# EAGLE schematic XR_Preamp (EAGLE 6.3)

## Sheet 1 of 2
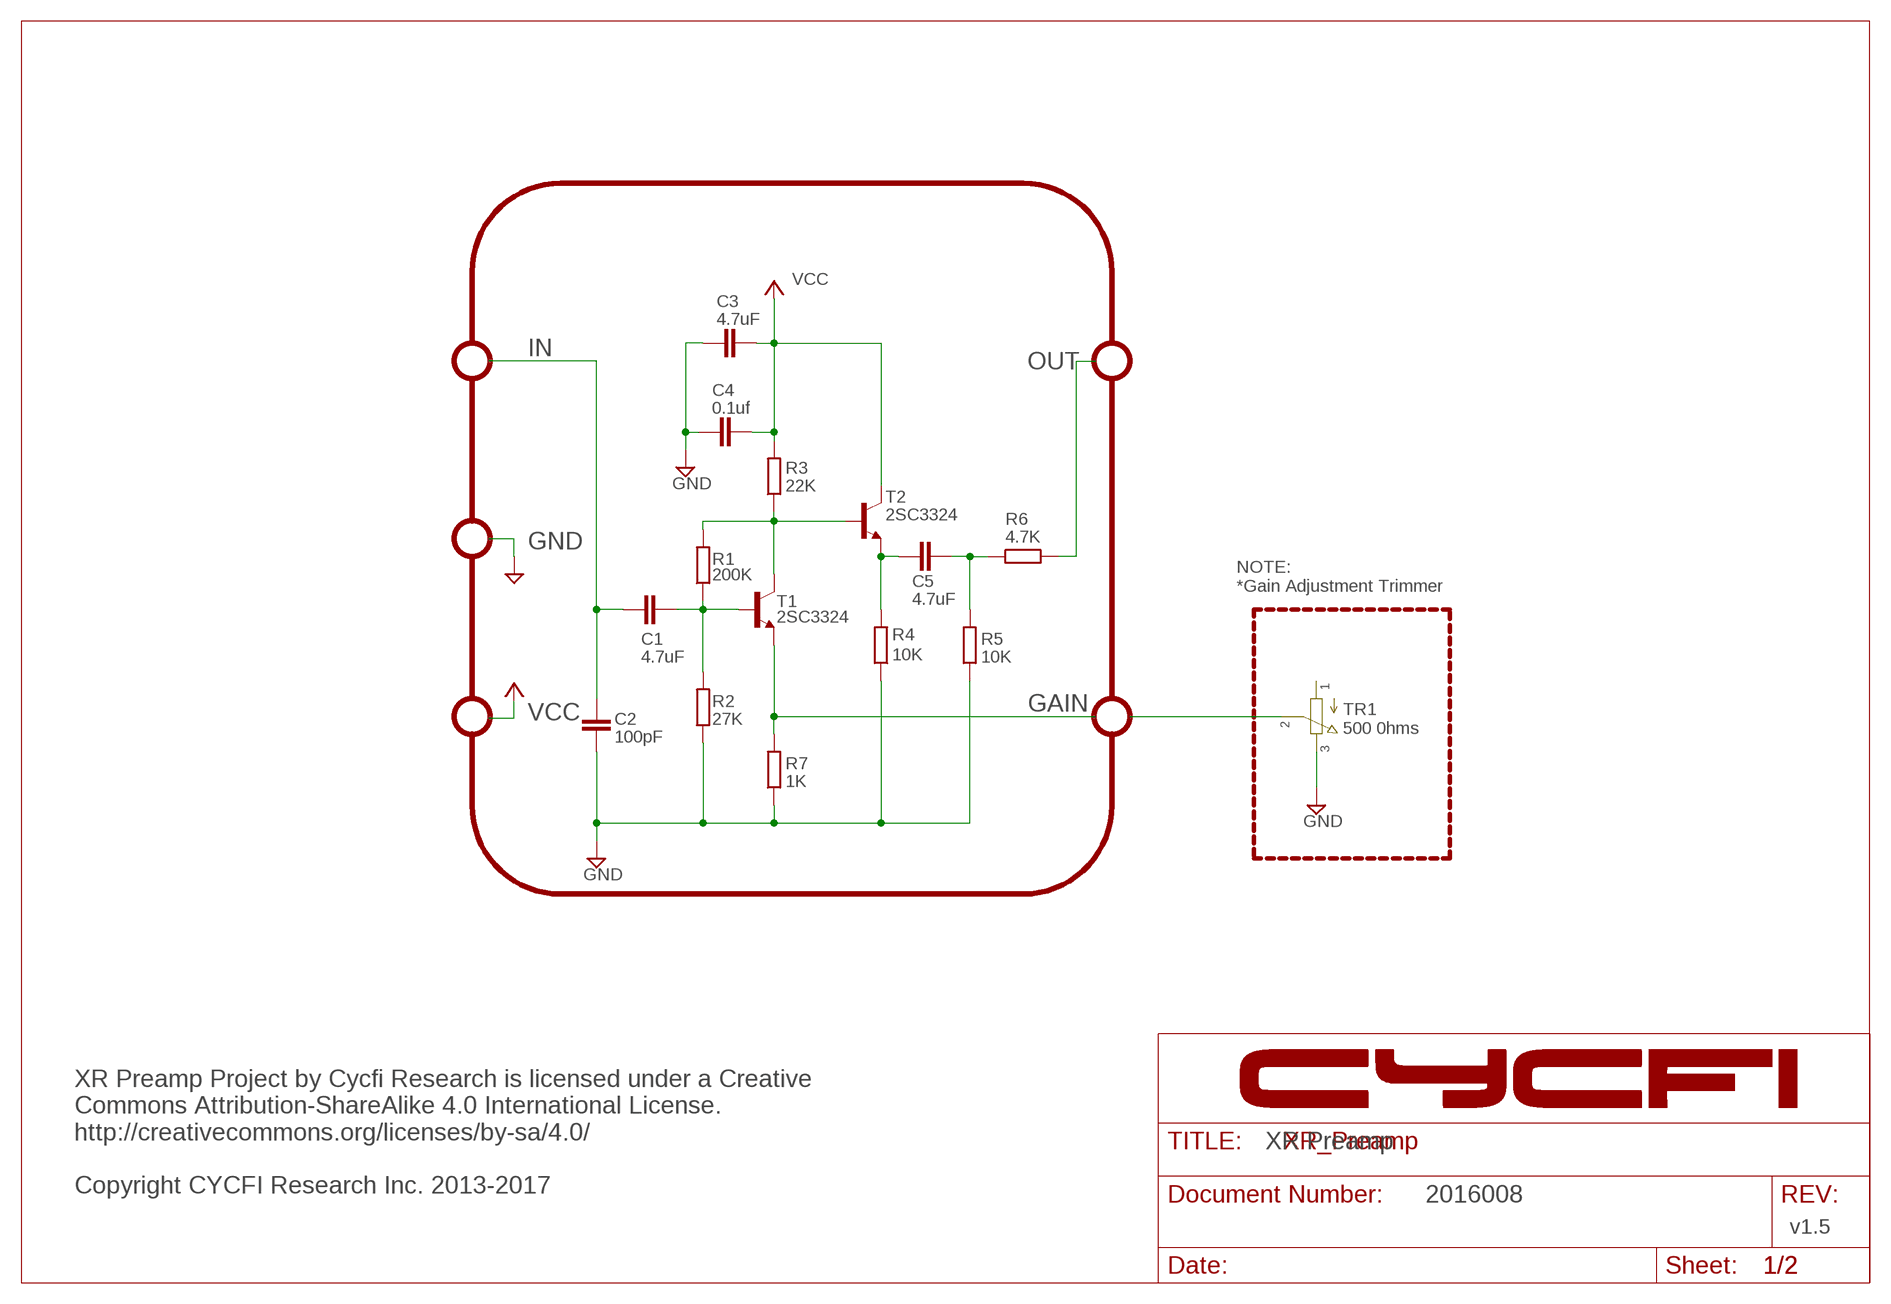
[diagram p0: schematic, sheet 1]

### Parts
C1  4.7uF  C-EUC0603  [C0603]
C2  100pF  C-EUC0402  [C0402]
C3  4.7uF  C-EUC0603  [C0603]
C4  0.1uf  C-EUC0402  [C0402]
C5  4.7uF  C-EUC0402  [C0402]
R1  200K  R-EU_R0402  [R0402]
R2  27K  R-EU_R0402  [R0402]
R3  22K  R-EU_R0402  [R0402]
R4  10K  R-EU_R0402  [R0402]
R5  10K  R-EU_R0402  [R0402]
R6  4.7K  R-EU_R0402  [R0402]
R7  1K  R-EU_R0402  [R0402]
T1  2SC3324  BC846  [SOT23]
T2  2SC3324  BC846  [SOT23]

### Nets
GAIN: R7.2 T1.2(E) ; also sheet 2
GND: C2.1 C3.1 C4.1 R2.1 R4.1 R5.1 R7.1 ; also sheet 2
IN: C1.1 C2.2 ; also sheet 2
N$1: C1.2 R1.1 R2.2 T1.1(B)
N$3: C5.2 R4.2 T2.2(E)
OUT: R6.2 ; also sheet 2
OUT1: C5.1 R5.2 R6.1
VCC: C3.2 C4.2 R3.2 T2.3(C) ; also sheet 2
VCVF: R1.2 R3.1 T1.3(C) T2.1(B)

### Notes on the sheet
- NOTE:
  *Gain Adjustment Trimmer
- 1
- 2
- TR1
  500 0hms
- 3
- XR Preamp
- XR Preamp Project by Cycfi Research is licensed under a Creative
  Commons Attribution-ShareAlike 4.0 International License.
  http://creativecommons.org/licenses/by-sa/4.0/
  
  Copyright CYCFI Research Inc. 2013-2017
- 2016008
- v1.5
- 1/2

## Sheet 2 of 2
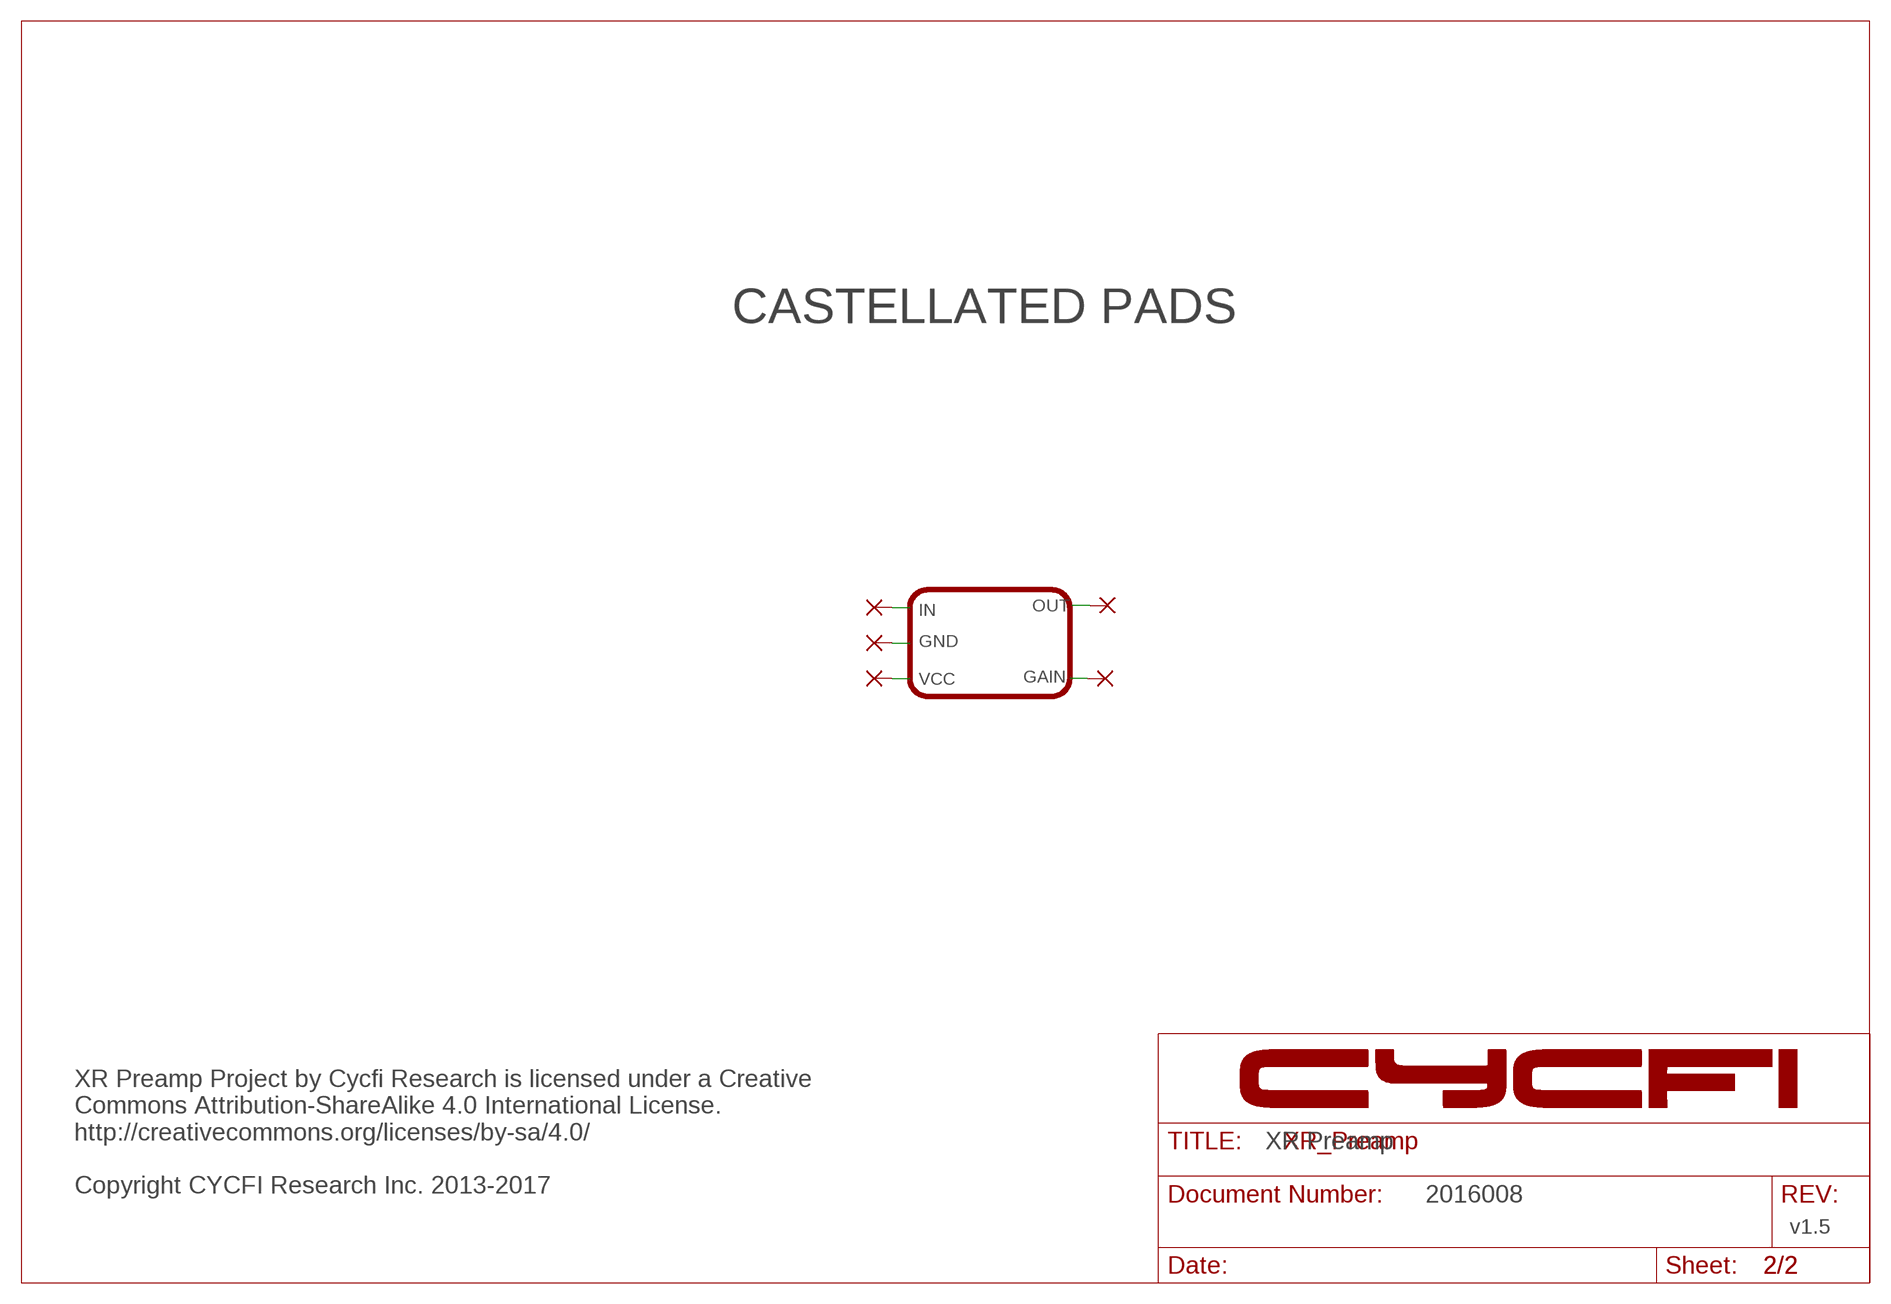
[diagram p1: schematic, sheet 2]

### Parts
PAD1  WIREPAD2,15/1,0  1,6/0,8  [1,6/0,8]
PAD2  WIREPAD2,15/1,0  1,6/0,8  [1,6/0,8]
PAD3  WIREPAD2,15/1,0  1,6/0,8  [1,6/0,8]
PAD4  WIREPAD2,15/1,0  1,6/0,8  [1,6/0,8]
PAD5  WIREPAD2,15/1,0  1,6/0,8  [1,6/0,8]

### Nets
GAIN: PAD1.1(P) ; also sheet 1
GND: PAD2.1(P) ; also sheet 1
IN: PAD3.1(P) ; also sheet 1
OUT: PAD5.1(P) ; also sheet 1
VCC: PAD4.1(P) ; also sheet 1

### Notes on the sheet
- CASTELLATED PADS
- GND
- VCC
- XR Preamp
- XR Preamp Project by Cycfi Research is licensed under a Creative 
  Commons Attribution-ShareAlike 4.0 International License. 
  http://creativecommons.org/licenses/by-sa/4.0/
  
  Copyright CYCFI Research Inc. 2013-2017
- 2016008
- v1.5
- 2/2

## Library data of the parts
C1-C5 = resistor:C-EU: CAPACITOR, European symbol
PAD1-PAD5 = wirepad:1,6/0,8: THROUGH-HOLE PAD
R1-R7 = resistor:R-EU_: RESISTOR, European symbol
T1 T2 = transistor:BC846: NPN TRANSISTOR